# EAGLE design untitled (EAGLE 9.6.2)
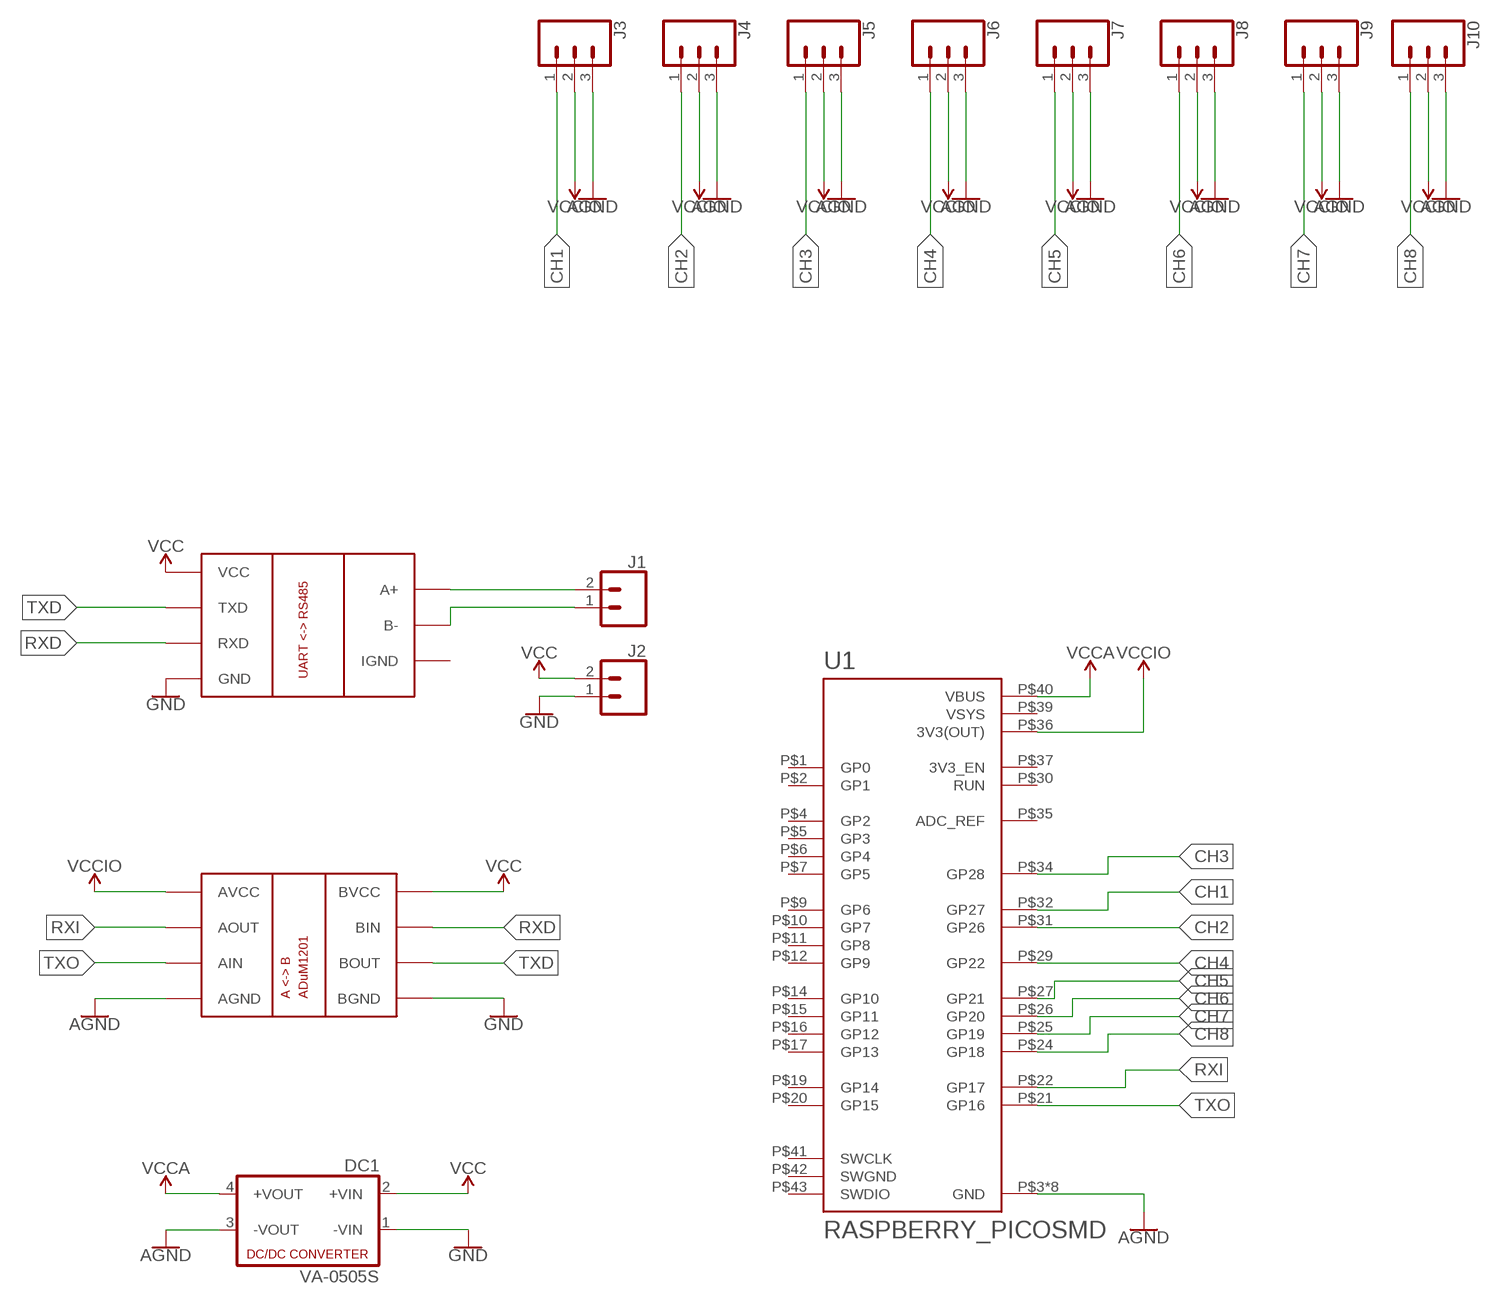
[diagram p0: schematic, sheet 1]

## Parts
DC1  VA-0505S  [4SIL]
J1  CONN_025MM  [SCREWTERMINAL-5MM-2]
J2  CONN_025MM  [SCREWTERMINAL-5MM-2]
J3  CONN_03  [1X03]
J4  CONN_03  [1X03]
J5  CONN_03  [1X03]
J6  CONN_03  [1X03]
J7  CONN_03  [1X03]
J8  CONN_03  [1X03]
J9  CONN_03  [1X03]
J10  CONN_03  [1X03]
U1  RASPBERRY_PICOSMD  [PICO-PKG-SMD]
U$1  RS485-UART-CONVERTER  [RS485_MODULE]
U$2  ADUM1201  [SO8]

## Nets
AGND: DC1.3(-VOUT) J3.3 J4.3 J5.3 J6.3 J7.3 J8.3 J9.3 J10.3 U1.P$3(GND) U1.P$8(GND) U1.P$13(GND) U1.P$18(GND) U1.P$23(GND) U1.P$28(GND) U1.P$33(GND) U1.P$38(GND) U$2.4(AGND)
CH1: J3.1 U1.P$32(GP27)
CH2: J4.1 U1.P$31(GP26)
CH3: J5.1 U1.P$34(GP28)
CH4: J6.1 U1.P$29(GP22)
CH5: J7.1 U1.P$27(GP21)
CH6: J8.1 U1.P$26(GP20)
CH7: J9.1 U1.P$25(GP19)
CH8: J10.1 U1.P$24(GP18)
GND: DC1.1(-VIN) J2.1 U$1.GND U$2.5(BGND)
N$1: J1.2 U$1.A+
N$2: J1.1 U$1.B-
RXD: U$1.RXD U$2.7(BIN)
RXI: U1.P$22(GP17) U$2.2(AOUT)
TXD: U$1.TXD U$2.6(BOUT)
TXO: U1.P$21(GP16) U$2.3(AIN)
VCC: DC1.2(+VIN) J2.2 U$1.VCC U$2.8(BVCC)
VCCA: DC1.4(+VOUT) U1.P$40(VBUS)
VCCIO: J3.2 J4.2 J5.2 J6.2 J7.2 J8.2 J9.2 J10.2 U1.P$36(3V3(OUT)) U$2.1(AVCC)
Unconnected: U1.P$1(GP0) U1.P$2(GP1) U1.P$4(GP2) U1.P$5(GP3) U1.P$6(GP4) U1.P$7(GP5) U1.P$9(GP6) U1.P$10(GP7) U1.P$11(GP8) U1.P$12(GP9) U1.P$14(GP10) U1.P$15(GP11) U1.P$16(GP12) U1.P$17(GP13) U1.P$19(GP14) U1.P$20(GP15) U1.P$30(RUN) U1.P$35(ADC_REF) U1.P$37(3V3_EN) U1.P$41(SWCLK) U1.P$43(SWDIO) U$1.ISOGND(IGND)

## Power pins joined to a net without a drawn wire
SWGND: U1.P$42(SWGND)
VSYS: U1.P$39(VSYS)

## Library data of the parts
DC1 = dc-dc-converter:VA-*?: DC DC Converter Single Output, 1 Watt Motien Technology Co.,Ltd. Source: Data sheet <http://www.motien.com.tw/data_sheet/VA-1%28H%29.pdf>; OC_FARNELL: unknown; OC_NEWARK: unknown
J1 J2 = SparkFun-Connectors:CONN_02: Multi connection point. Often used as Generic Header-pin footprint for 0.1 inch spaced/style header connections On any of the 0.1 inch spaced packages, you can populate with these: Break Away Headers - Straight <https://www.sparkfun.com/products/116> (PRT-00116) Break Away Male Headers - Right Angle <https://www.sparkfun.com/products/553> (PRT-00553) Female Headers <https://www.sparkfun.com/products/115> (PRT-00115) Break Away Headers - Machine Pin <https://www.sparkfun.com/products/117> (PRT-00117) Break Away Female Headers - Swiss Machine Pin <https://www.sparkfun.com/products/743> (PRT-00743) For SCREWTERMINALS and SPRING TERMINALS visit here: Screw Terimnals on SparkFun.com <https://www.sparkfun.com/search/results?term=Screw+Terminals> (5mm/3.5mm/2.54mm spacing) This device is also useful as a general connection point to wire up your design to another part of your project. Our various solder wires solder well into these plated through hole pads. Hook-Up Wire - Assortment (Stranded, 22 AWG) <https://www.sparkfun.com/products/11375> (PRT-11375) Hook-Up Wire - Assortment (Solid Core, 22 AWG) <https://www.sparkfun.com/products/11367> (PRT-11367) View the entire wire category on our website here <https://www.sparkfun.com/categories/141> Special notes: Molex polarized connector foot print use with: PRT-08233 with associated crimp pins and housings. 2.54_SCREWTERM for use with PRT-10571. 3.5mm Screw Terminal footprints for PRT-08084 5mm Screw Terminal footprints for use with PRT-08432; SF_SKU: PRT-08432
J3-J10 = SparkFun-Connectors:CONN_03: Multi connection point. Often used as Generic Header-pin footprint for 0.1 inch spaced/style header connections On any of the 0.1 inch spaced packages, you can populate with these: Break Away Headers - Straight <https://www.sparkfun.com/products/116> (PRT-00116) Break Away Male Headers - Right Angle <https://www.sparkfun.com/products/553> (PRT-00553) Female Headers <https://www.sparkfun.com/products/115> (PRT-00115) Break Away Headers - Machine Pin <https://www.sparkfun.com/products/117> (PRT-00117) Break Away Female Headers - Swiss Machine Pin <https://www.sparkfun.com/products/743> (PRT-00743) Stackable Header - 3 Pin (Female, 0.1") <https://www.sparkfun.com/products/13875> (PRT-13875) For SCREWTERMINALS and SPRING TERMINALS visit here: Screw Terimnals on SparkFun.com <https://www.sparkfun.com/search/results?term=Screw+Terminals> (5mm/3.5mm/2.54mm spacing) This device is also useful as a general connection point to wire up your design to another part of your project. Our various solder wires solder well into these plated through hole pads. Hook-Up Wire - Assortment (Stranded, 22 AWG) <https://www.sparkfun.com/products/11375> (PRT-11375) Hook-Up Wire - Assortment (Solid Core, 22 AWG) <https://www.sparkfun.com/products/11367> (PRT-11367) View the entire wire category on our website here <https://www.sparkfun.com/categories/141> Special notes: Molex polarized connector foot print use with SKU : PRT-08232 with associated crimp pins and housings.; PROD_ID: XXX-00000; VALUE: 455-1750-1-ND
U1 = RpiPico:RASPBERRY_PICO: Raspberry Pi Pico
U$1 = Hatch Prototype:RS485-UART-CONVERTER
U$2 = Hatch Prototype:ADUM1201

## Board
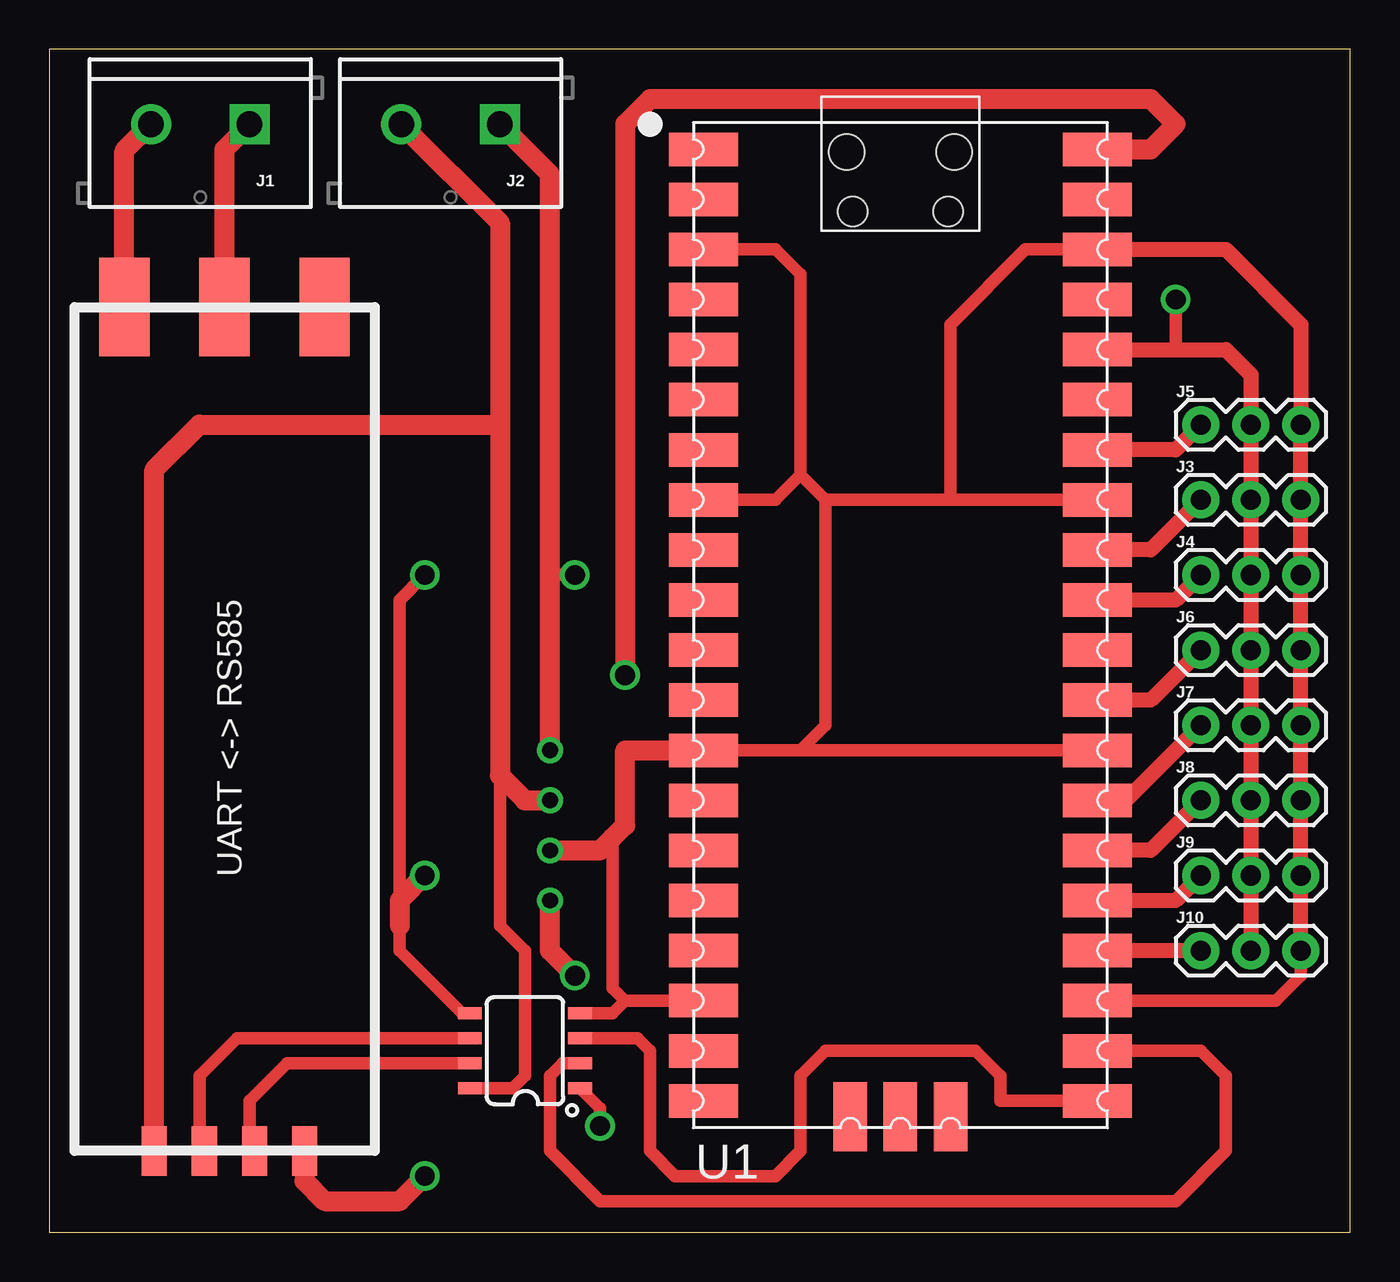
[diagram p1: board, top side]
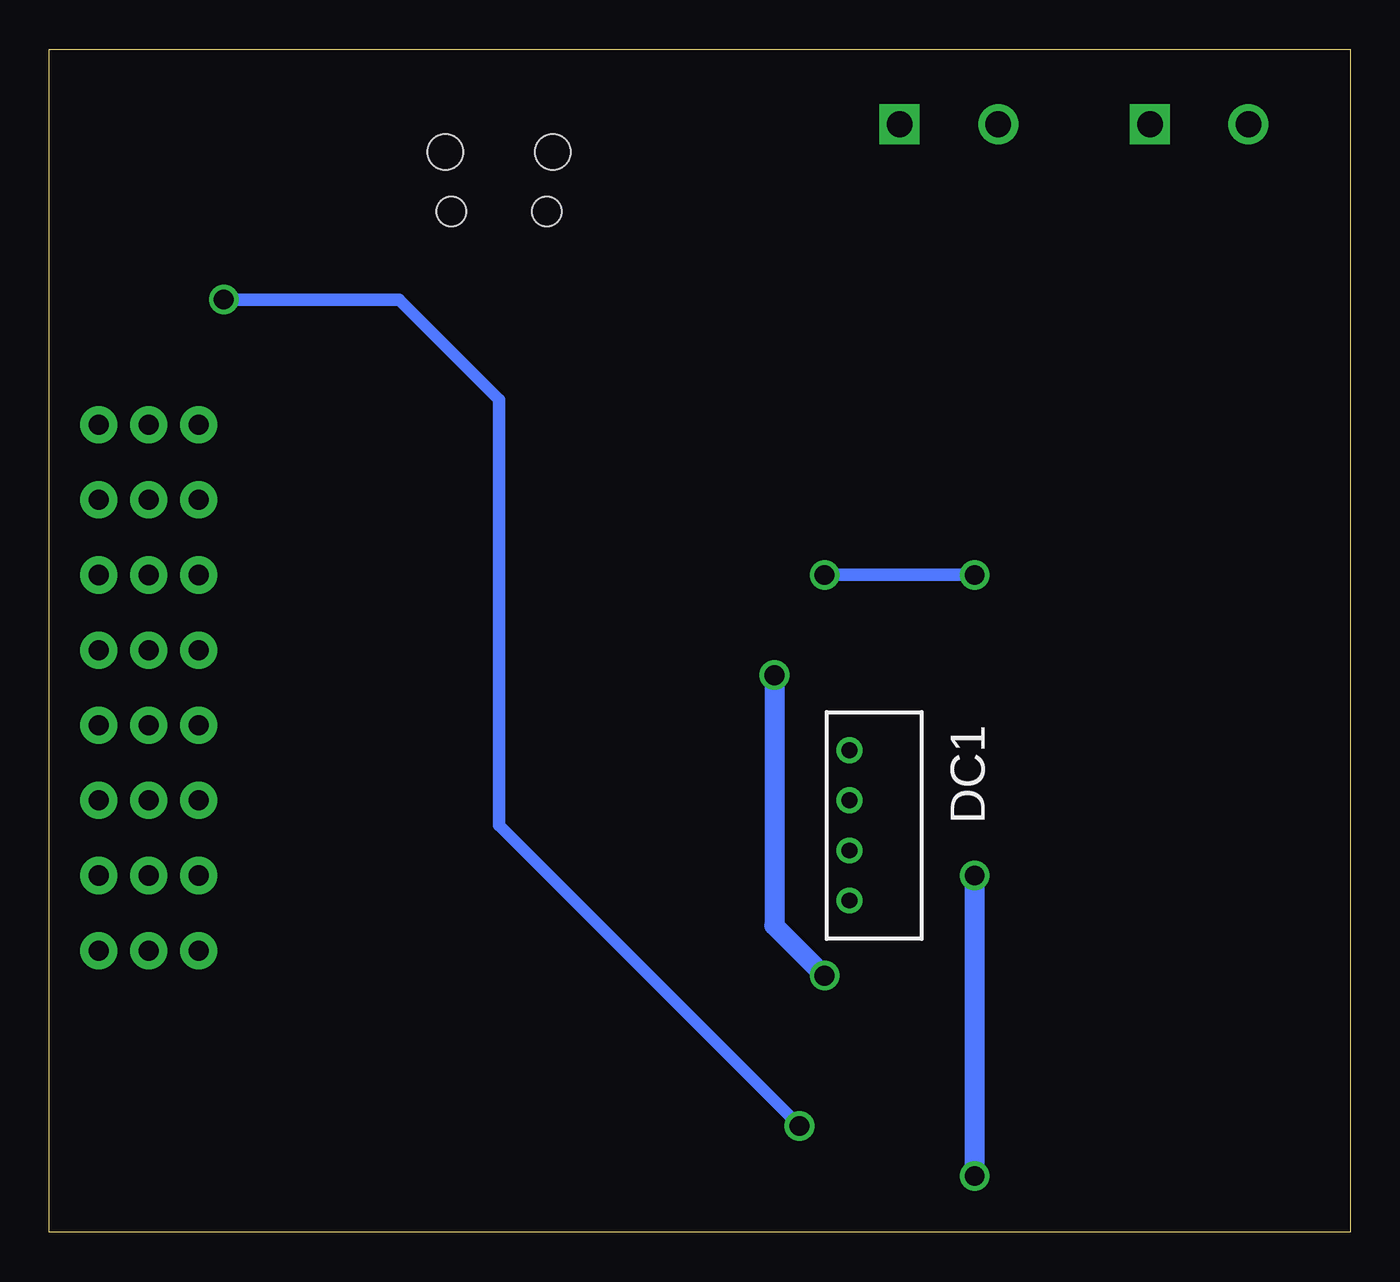
[diagram p2: board, bottom side, seen from below]

Size 66 x 60 mm. Coordinates in mm from the lower left corner, seen from the top.
Outline: 0,0 66,0 66,60 0,60 0,0
Copper layers (1*16): Top 0.035mm / dielectric 1.5mm / Bottom 0.035mm
Design rules "default": minimum track width 6mil, minimum drill 0.35mm, track to track 6mil, track to pad 6mil, pad to pad 6mil, via to via 6mil, smd to smd 6mil, copper to edge 40mil, drill to drill 6mil, minimum pad ring 10mil, minimum via ring 8mil, stop-mask expansion 4mil, vias tented up to drill 0mil, thermal gap 10mil

### Footprints (pad centres in the part's own frame; a part is rotated, then mirrored left to right if it is on the bottom)
4SIL = drill 0.8: 1 -3.81,0; 2 -1.27,0; 3 1.27,0; 4 3.81,0
SCREWTERMINAL-5MM-2 = drill 1.3 pad 2.032 square: 1 0,0 | drill 1.3 pad 2.032: 2 5,0
1X03 = drill 1.016 pad 1.88: 1 0,0; 2 2.54,0; 3 5.08,0
PICO-PKG-SMD = smd 3.5 x 1.7: P$1 -10,24.13; P$2 -10,21.59; P$3 -10,19.05; P$4 -10,16.51; P$5 -10,13.97; P$6 -10,11.43; P$7 -10,8.89; P$8 -10,6.35; P$9 -10,3.81; P$10 -10,1.27; P$11 -10,-1.27; P$12 -10,-3.81; P$13 -10,-6.35; P$14 -10,-8.89; P$15 -10,-11.43; P$16 -10,-13.97; P$17 -10,-16.51; P$18 -10,-19.05; P$19 -10,-21.59; P$20 -10,-24.13; P$21 10,-24.13; P$22 10,-21.59; P$23 10,-19.05; P$24 10,-16.51; P$25 10,-13.97; P$26 10,-11.43; P$27 10,-8.89; P$28 10,-6.35; P$29 10,-3.81; P$30 10,-1.27; P$31 10,1.27; P$32 10,3.81; P$33 10,6.35; P$34 10,8.89; P$35 10,11.43; P$36 10,13.97; P$37 10,16.51; P$38 10,19.05; P$39 10,21.59; P$40 10,24.13 | smd 1.7 x 3.5: P$41 -2.54,-24.925; P$42 0,-24.925; P$43 2.54,-24.925 | hole 1.8: -2.725,24; 2.725,24 | hole 1.5: -2.425,20.97; 2.425,20.97
RS485_MODULE = smd 5 x 2.55: A+ 42.8,12.7; B- 42.8,7.62; ISOGND 42.8,2.54 | smd 2.5 x 1.27: GND 0,3.56; RXD 0,6.1; TXD 0,8.64; VCC 0,11.18
SO8 = smd 0.6 x 1.2: 1 -1.905,-2.8; 2 -0.635,-2.8; 3 0.635,-2.8; 4 1.905,-2.8; 5 1.905,2.8; 6 0.635,2.8; 7 -0.635,2.8; 8 -1.905,2.8

### Placement (x,y rotation side)
DC1  25.4,20.64 270 bottom
J1  10.16,56.2 180 top
J2  22.86,56.2 180 top
J3  58.42,37.15 0 top
J4  58.42,33.34 0 top
J5  58.42,40.96 0 top
J6  58.42,29.53 0 top
J7  58.42,25.72 0 top
J8  58.42,21.91 0 top
J9  58.42,18.1 0 top
J10  58.42,14.29 0 top
U1  43.18,30.8 0 top
U$1  16.51,4.13 90 top
U$2  24.13,9.21 90 top

### Tracks (layer width: path | path; a pad name or v marks a point on that pad's centre or on a via)
AGND
  Top 0.635: U$2.4 28.57,11.11 29.21,11.75 | 29.21,11.75 U1.P$18 | U1.P$23 62.23,11.75 63.5,13.02 J10.3 | 28.57,20.01 28.57,12.38 29.21,11.75 | U1.P$3 36.83,49.85 38.1,48.58 38.1,38.42 | 38.1,38.42 36.83,37.15 U1.P$8 | U1.P$13 38.1,24.45 | 38.1,24.45 39.37,25.72 39.37,37.15 | 39.37,37.15 38.1,38.42 | U1.P$33 45.72,37.15 | 45.72,37.15 39.37,37.15 | U1.P$28 38.1,24.45 | U1.P$38 49.53,49.85 45.72,46.04 45.72,37.15
  Top 0.762: J10.3 J9.3 J8.3 J7.3 J6.3 J4.3 J3.3 J5.3 63.5,46.04 59.69,49.85 U1.P$38
  Top 1.016: DC1.3 27.94,19.37 28.57,20.01 29.21,20.64 29.21,24.45 U1.P$13
CH1
  Top 0.762: J3.1 55.88,34.61 U1.P$32
CH2
  Top 0.762: J4.1 57.15,32.07 U1.P$31 52.07,32.07
CH3
  Top 0.762: J5.1 57.15,39.69 U1.P$34
CH4
  Top 0.762: J6.1 55.88,26.99 U1.P$29
CH5
  Top 0.762: J7.1 54.61,21.91 U1.P$27
CH6
  Top 0.762: J8.1 55.88,19.37 U1.P$26
CH7
  Top 0.762: J9.1 57.15,16.83 U1.P$25
CH8
  Top 0.762: J10.1 U1.P$24
GND  (via drill 1)
  Top 0.635: U$2.5 20.95,11.11 17.78,14.29 17.78,15.56 17.78,32.07 v19.05,33.34 | v26.67,33.34 25.4,33.34
  Top 1.016: DC1.1 25.4,33.34 25.4,53.66 J2.1 | U$1.GND 12.95,2.61 13.97,1.59 17.78,1.59 v19.05,2.86 | v19.05,18.1 17.78,16.83 17.78,15.56
  Bottom 0.635: v19.05,33.34 v26.67,33.34
  Bottom 1.016: v19.05,2.86 v19.05,18.1
N$1
  Top 1.016: U$1.A+ 3.81,54.85 J1.2
N$2
  Top 1.016: U$1.B- 8.89,54.93 J1.1
RXD
  Top 0.635: U$2.7 12.06,8.57 10.16,6.67 10.16,4.38 U$1.RXD
RXI
  Top 0.635: U$2.2 26.04,8.57 25.4,7.94 25.4,4.13 27.94,1.59 57.15,1.59 59.69,4.13 59.69,7.94 58.42,9.21 U1.P$22
TXD
  Top 0.635: U$2.6 9.53,9.84 7.62,7.94 7.62,4.38 U$1.TXD
TXO
  Top 0.635: U$2.3 29.84,9.84 30.48,9.21 30.48,4.13 31.75,2.86 36.83,2.86 38.1,4.13 38.1,7.94 39.37,9.21 46.99,9.21 48.26,7.94 48.26,6.67 U1.P$21
VCC
  Top 0.635: U$2.8 23.5,7.3 24.13,7.94 24.13,14.29 22.86,15.56 22.86,23.18
  Top 1.016: J2.2 22.86,51.2 22.86,40.96 | 22.86,40.96 22.86,23.18 24.13,21.91 DC1.2 | U$1.VCC 5.33,38.67 7.62,40.96 22.86,40.96
VCCA  (via drill 1)
  Top 1.016: U1.P$40 55.88,54.93 57.15,56.2 55.88,57.47 30.48,57.47 29.21,56.2 v29.21,28.26 | v26.67,13.02 25.4,14.29 DC1.4
  Bottom 1.016: v29.21,28.26 29.21,15.56 v26.67,13.02
VCCIO  (via drill 1)
  Top 0.635: U$2.1 27.94,6.3 v27.94,5.4 | v57.15,47.31 57.15,44.77
  Top 0.762: J10.2 J9.2 J8.2 J7.2 J6.2 J4.2 J3.2 J5.2 60.96,43.5 59.69,44.77 57.15,44.77 U1.P$36
  Bottom 0.635: v27.94,5.4 43.18,20.64 43.18,42.23 48.26,47.31 v57.15,47.31